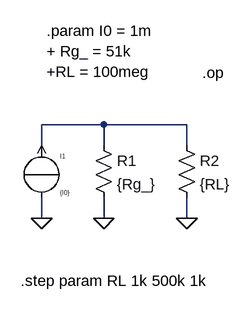
[diagram p0: schematic nr.asc]
nr.asc, the LTspice schematic file:
Version 4
SHEET 1 880 680
WIRE 48 96 -48 96
WIRE 176 96 48 96
WIRE -48 128 -48 96
WIRE 48 128 48 96
WIRE 176 128 176 96
WIRE -48 240 -48 208
WIRE 48 240 48 208
WIRE 176 240 176 208
FLAG -48 240 0
FLAG 48 240 0
FLAG 176 240 0
SYMBOL MDB_sym\\source-I -48 128 R0
WINDOW 123 0 0 Left 2
WINDOW 39 0 0 Left 2
SYMATTR InstName I1
SYMATTR Value {I0}
SYMBOL res 32 112 R0
SYMATTR InstName R1
SYMATTR Value {Rg_}
SYMBOL res 160 112 R0
SYMATTR InstName R2
SYMATTR Value {RL}
TEXT -40 -48 Left 2 !.param I0 = 1m\n+ Rg_ = 51k\n+RL = 100meg
TEXT -80 336 Left 2 !.step param RL 1k 500k 1k
TEXT 200 16 Left 2 !.op

The netlist it stands for:
* nr.asc
I1 0 N001 {I0}
R1 N001 0 {Rg_}
R2 N001 0 {RL}
.param I0 = 1m
+ Rg_ = 51k
+RL = 100meg
.step param RL 1k 500k 1k
.op
.backanno
.end